# EAGLE design Startgate Controller-Mainboard (EAGLE 7.7.0)
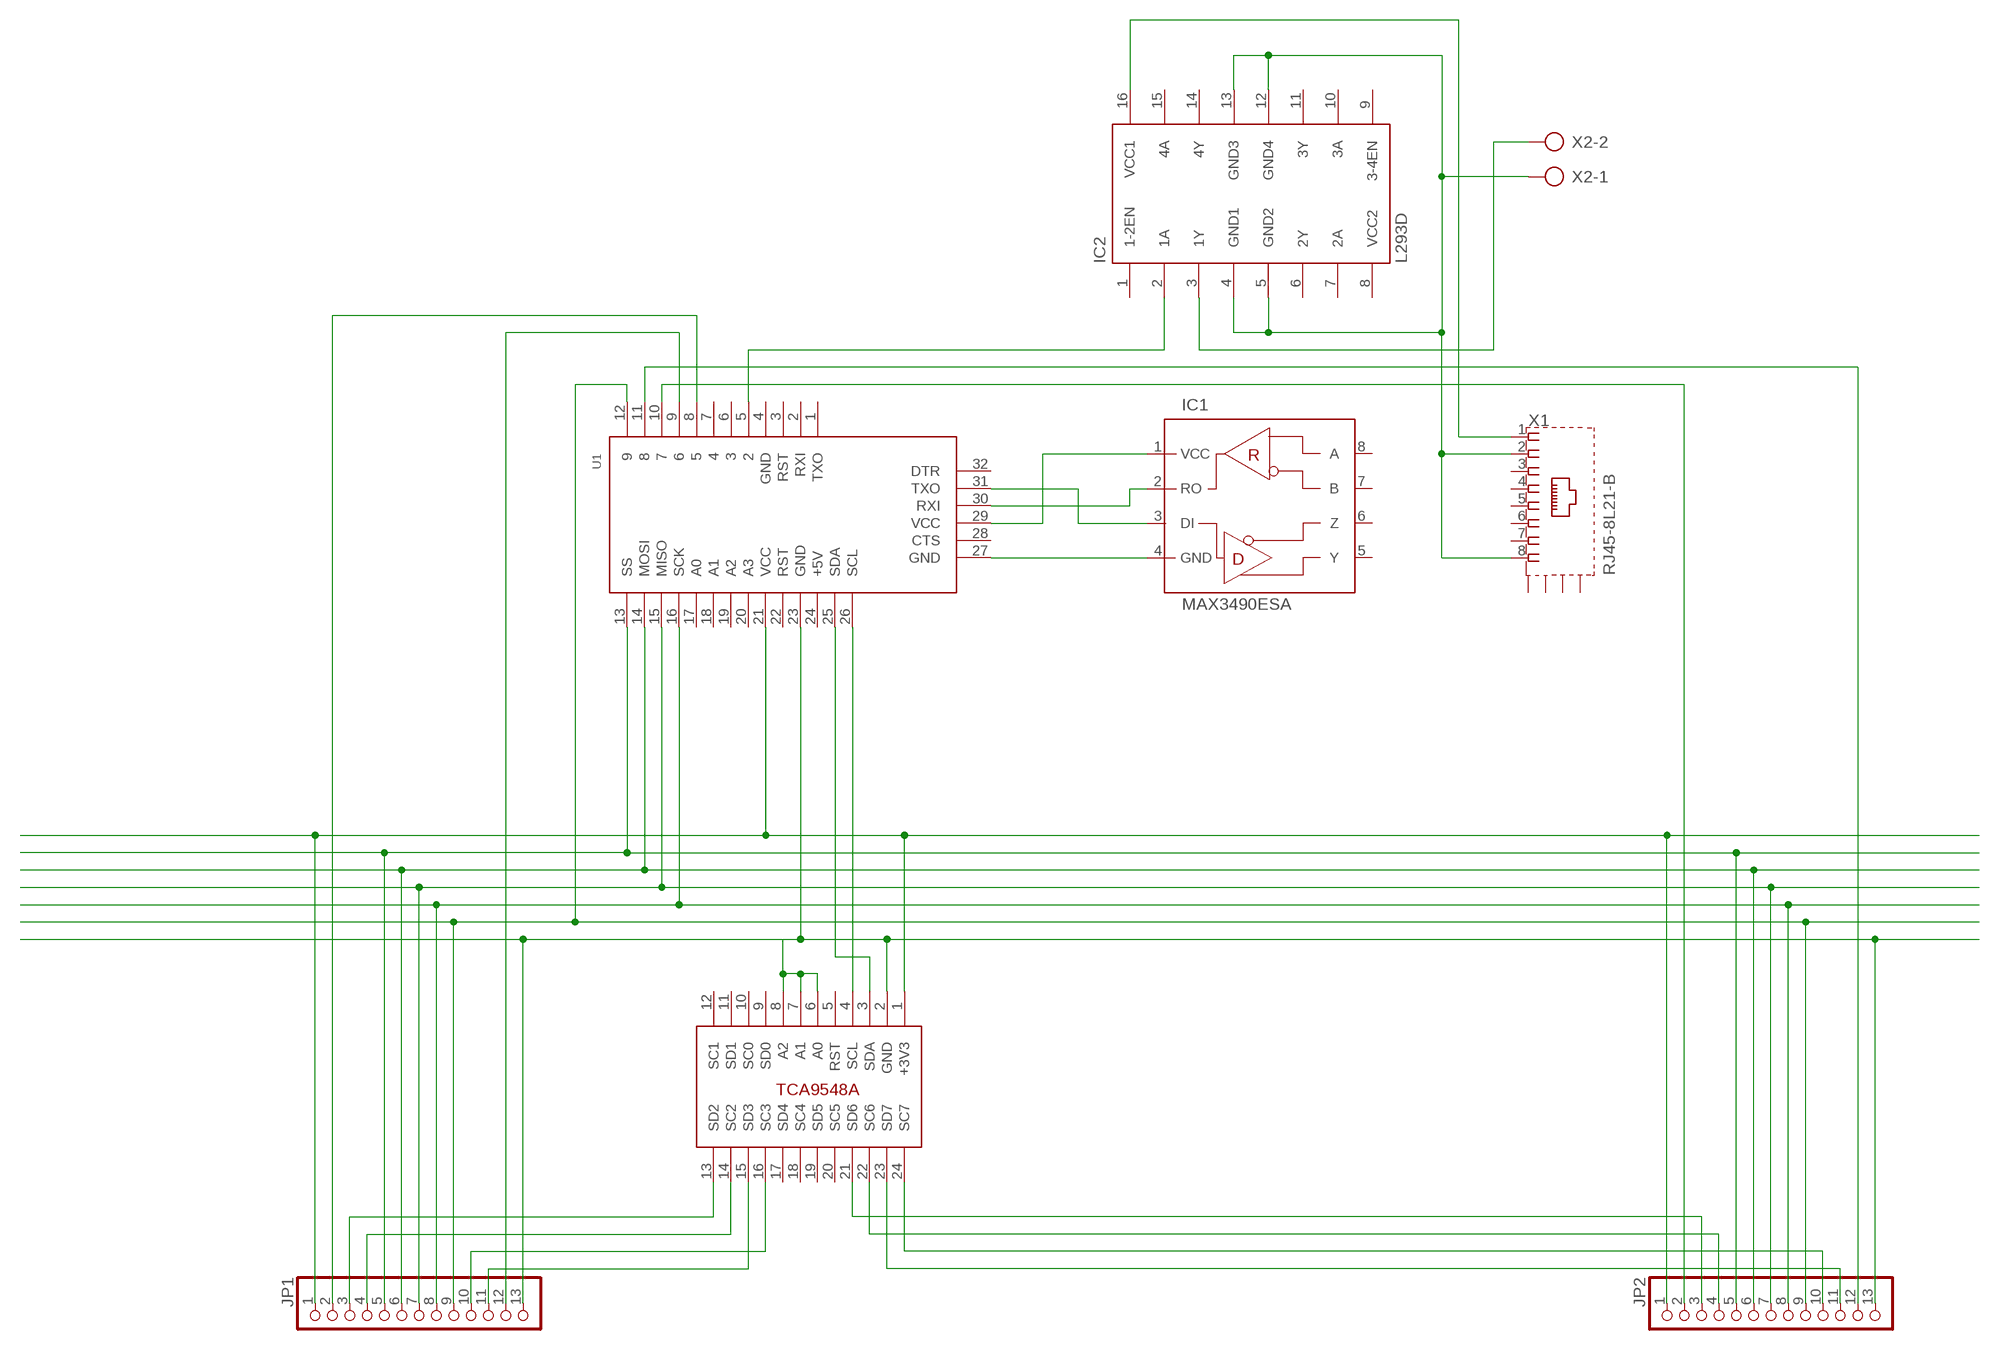
[diagram p0: schematic, sheet 1]

## Parts
IC1  MAX3490ESA  [SO08]
IC2  L293D  [DIL16]
JP1  PINHD-1X13  [1X13]
JP2  PINHD-1X13  [1X13]
U1  ARDUINOPROMINI  [ARDUINOPROMINI]
U$1  TCA9548A  [DIL24]
X1  RJ45-8L21-B  [RJ45-SHIELD1]
X2  AK300/2  [AK300/2]

## Nets
+3V3: IC1.1(VCC) JP1.1 JP2.1 U1.21(VCC) U1.29(VCC) U$1.1(+3V3)
ENA1: JP1.2 U1.8
ENA2: JP1.12 U1.9
ENA3: JP2.2 U1.10
ENA4: JP2.12 U1.11
GND: IC1.4(GND) JP1.13 JP2.13 U1.23(GND) U1.27(GND) U$1.2(GND) U$1.6(A0) U$1.7(A1) U$1.8(A2)
MISO: JP1.7 JP2.7 U1.15(MISO)
MOSI: JP1.6 JP2.6 U1.14(MOSI)
N$1: IC1.3(DI) U1.31(TXO)
N$2: IC1.2(RO) U1.30(RXI)
N$5: U1.26(SCL) U$1.4(SCL)
N$6: U1.25(SDA) U$1.3(SDA)
N$10: IC2.2(1A) U1.5
N$11: IC2.3(1Y) X2.2
N$12: IC2.16(VCC1) X1.1
N$13: IC2.4(GND1) IC2.5(GND2) IC2.12(GND4) IC2.13(GND3) X1.2 X1.8 X2.1
RST: JP1.9 JP2.9 U1.12
SCK: JP1.8 JP2.8 U1.16(SCK)
SCL1: JP1.4 U$1.14(SC2)
SCL2: JP1.10 U$1.16(SC3)
SCL3: JP2.4 U$1.22(SC6)
SCL4: JP2.10 U$1.24(SC7)
SDA1: JP1.3 U$1.13(SD2)
SDA2: JP1.11 U$1.15(SD3)
SDA3: JP2.3 U$1.21(SD6)
SDA4: JP2.11 U$1.23(SD7)
SS: JP1.5 JP2.5 U1.13(SS)
Unconnected: IC1.5(Y) IC1.6(Z) IC1.7(B) IC1.8(A) IC2.1(1-2EN) IC2.6(2Y) IC2.7(2A) IC2.9(3-4EN) IC2.10(3A) IC2.11(3Y) IC2.14(4Y) IC2.15(4A) U1.1(TXO) U1.2(RXI) U1.3(RST) U1.4(GND) U1.6 U1.7 U1.17(A0) U1.18(A1) U1.19(A2) U1.20(A3) U1.22(RST) U1.28(CTS) U1.32(DTR) U$1.5(RST) U$1.9(SD0) U$1.10(SC0) U$1.11(SD1) U$1.12(SC1) U$1.17(SD4) U$1.18(SC4) U$1.19(SD5) U$1.20(SC5) X1.3 X1.4 X1.5 X1.6 X1.7 X1.S1(S) X1.S2(S) X1.S3(S) X1.S4(S)

## Power pins joined to a net without a drawn wire
+5V: U1.24(+5V)
VCC2: IC2.8(VCC2)

## Library data of the parts
IC1 = miro:MAX3490: +3.3V 10Mbps, RS-485 Transceivers
IC2 = st-microelectronics:L293D: PUSH-PULL 4 CHANNEL DRIVER; MPN: L293D; OC_FARNELL: 9589619; OC_NEWARK: 56P8249
JP1 JP2 = pinhead:PINHD-1X13: PIN HEADER
U1 = miro:ARDUINOPROMINI: Arduino Pro Mini - the compete module
U$1 = miro:TCA9548A: TCA9548A is a low-voltage 8-channel I2C multiplexer
X1 = con-tycoelectronics:RJ45*2: RJ45 Low Profile Shield Type 2 For all RJ45 L, LC, LCT and X Series Models Source: www.tycoelectronics.com .. ENG_DS_1654001_1099_RJ_L_0507.pdf; OC_FARNELL: unknown; OC_NEWARK: unknown
X2 = con-ptr500:AK300/2: CONNECTOR; OC_FARNELL: unknown; OC_NEWARK: unknown

## Board
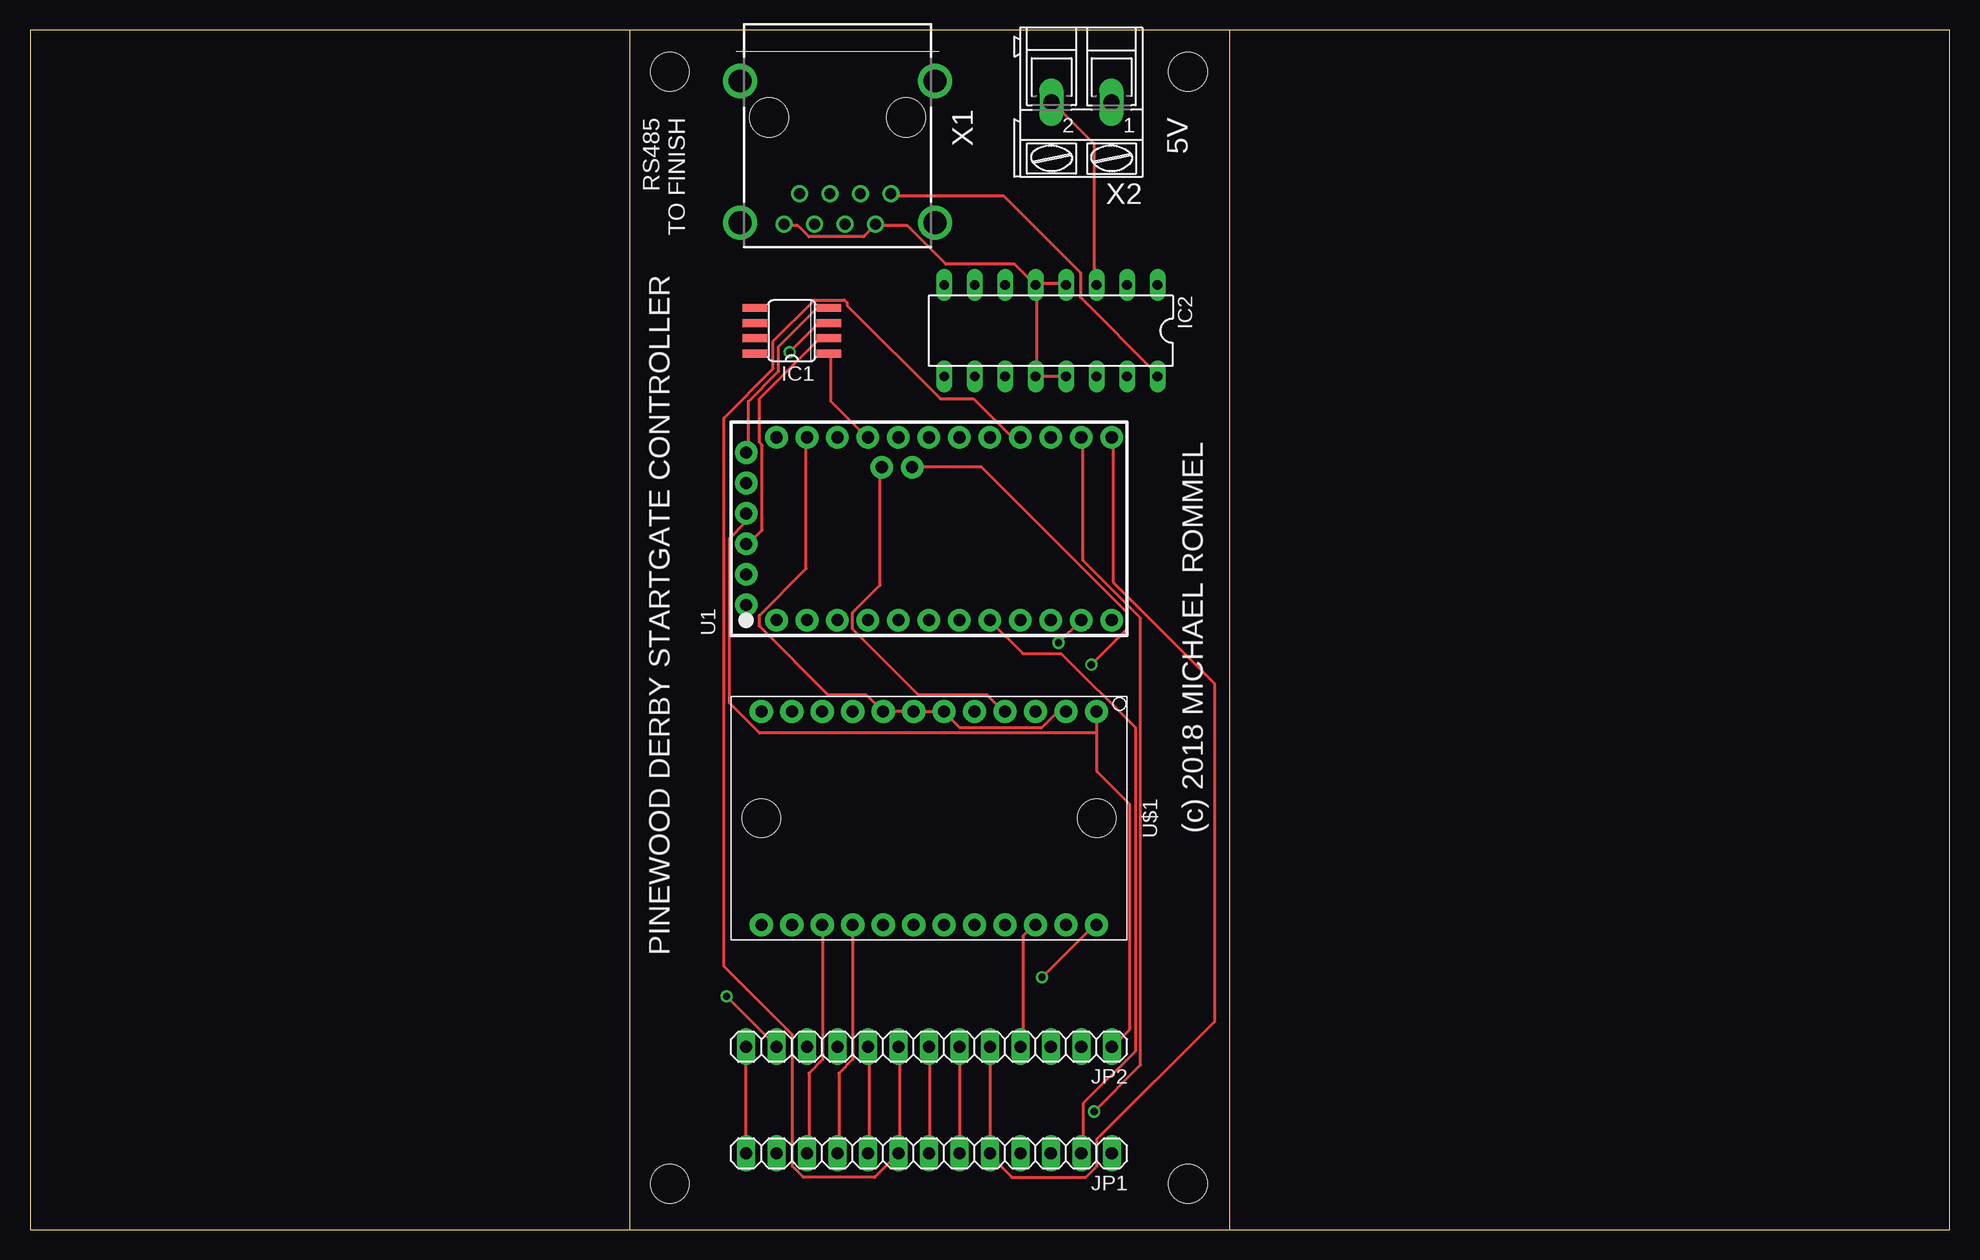
[diagram p1: board, top side]
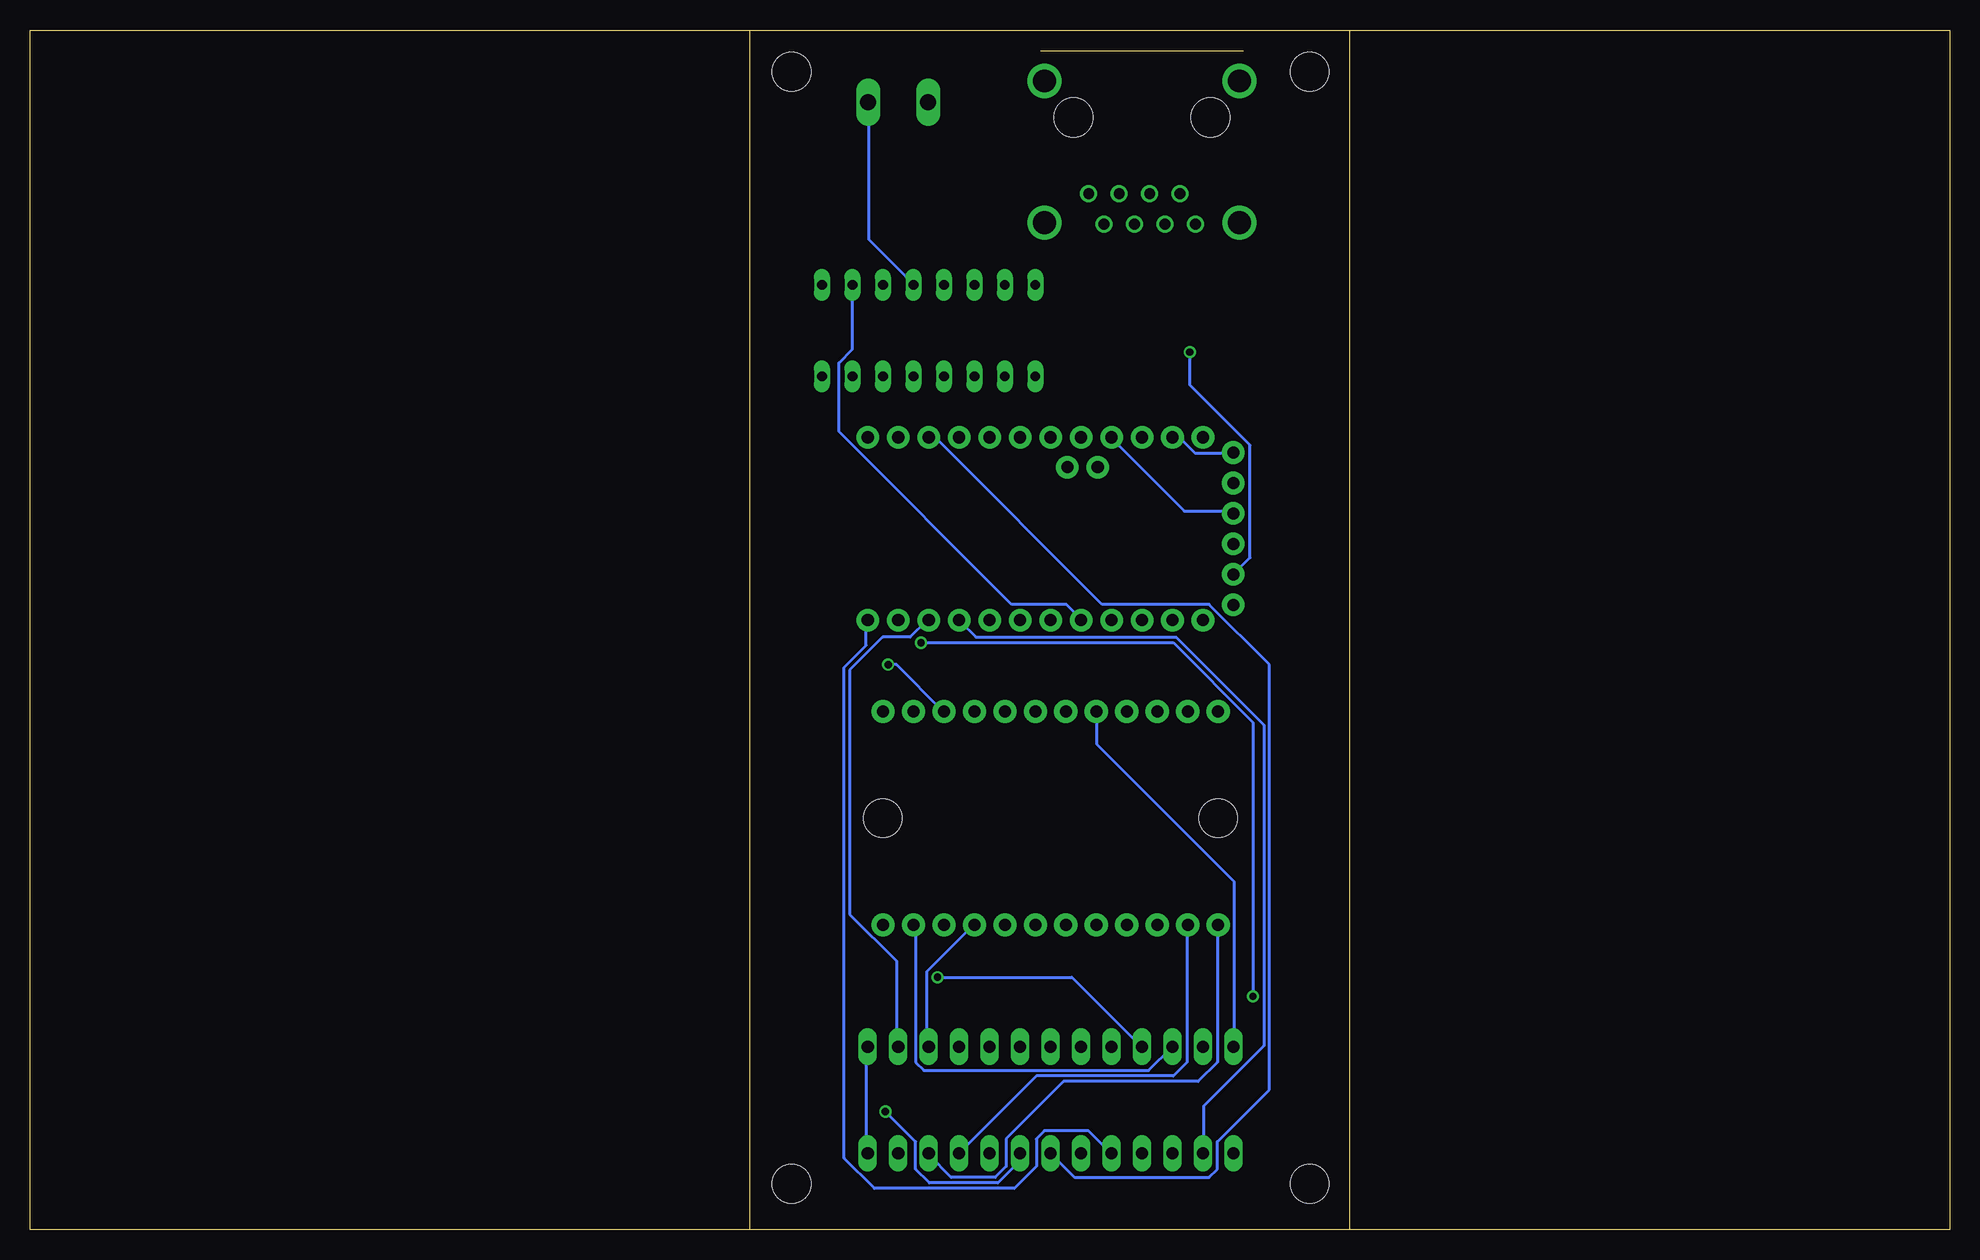
[diagram p2: board, bottom side, seen from below]

Size 160 x 100 mm. Coordinates in mm from the lower left corner, seen from the top.
Outline: 50,0 0,0 0,100 50,100
Outline: 50,0 100,0
Outline: 100,0 160,0 160,100 100,100
Outline: 100,100 50,100
Outline: 50,0 50,100
Outline: 100,0 100,100
Copper layers (1*16): Top 0.035mm / dielectric 1.5mm / Bottom 0.035mm
Design rules "default": minimum track width 10mil, minimum drill 24mil, track to track 8mil, track to pad 8mil, pad to pad 8mil, via to via 8mil, smd to smd 8mil, copper to edge 40mil, drill to drill 8mil, minimum pad ring 10mil, minimum via ring 8mil, stop-mask expansion 4mil, vias tented up to drill 0mil, thermal gap 10mil
Holes 3.2 mm at 53.34,96.52 96.52,96.52 53.34,3.81 96.52,3.81

### Footprints (pad centres in the part's own frame; a part is rotated, then mirrored left to right if it is on the bottom)
SO08 = smd 0.66 x 2.032: 1 -1.905,-3.073; 2 -0.635,-3.073; 3 0.635,-3.073; 4 1.905,-3.073; 5 1.905,3.073; 6 0.635,3.073; 7 -0.635,3.073; 8 -1.905,3.073
DIL16 = drill 0.813 long: 1 -8.89,-3.81; 2 -6.35,-3.81; 3 -3.81,-3.81; 4 -1.27,-3.81; 5 1.27,-3.81; 6 3.81,-3.81; 7 6.35,-3.81; 8 8.89,-3.81; 9 8.89,3.81; 10 6.35,3.81; 11 3.81,3.81; 12 1.27,3.81; 13 -1.27,3.81; 14 -3.81,3.81; 15 -6.35,3.81; 16 -8.89,3.81
1X13 = drill 1.016 long: 1 -15.24,0; 2 -12.7,0; 3 -10.16,0; 4 -7.62,0; 5 -5.08,0; 6 -2.54,0; 7 0,0; 8 2.54,0; 9 5.08,0; 10 7.62,0; 11 10.16,0; 12 12.7,0; 13 15.24,0
ARDUINOPROMINI = drill 1.016 pad 1.88: 1 1.27,29.21; 2 1.27,26.67; 3 1.27,24.13; 4 1.27,21.59; 5 1.27,19.05; 6 1.27,16.51; 7 1.27,13.97; 8 1.27,11.43; 9 1.27,8.89; 10 1.27,6.35; 11 1.27,3.81; 12 1.27,1.27; 13 16.51,1.27; 14 16.51,3.81; 15 16.51,6.35; 16 16.51,8.89; 17 16.51,11.43; 18 16.51,13.97; 19 16.51,16.51; 20 16.51,19.05; 21 16.51,21.59; 22 16.51,24.13; 23 16.51,26.67; 24 16.51,29.21; 25 14.021,17.907; 26 14.021,20.447; 27 15.24,31.75; 28 12.7,31.75; 29 10.16,31.75; 30 7.62,31.75; 31 5.08,31.75; 32 2.54,31.75
DIL24 = drill 1 pad 1.93: 1 1.27,30.48; 2 1.27,27.94; 3 1.27,25.4; 4 1.27,22.86; 5 1.27,20.32; 6 1.27,17.78; 7 1.27,15.24; 8 1.27,12.7; 9 1.27,10.16; 10 1.27,7.62; 11 1.27,5.08; 12 1.27,2.54; 13 19.05,2.54; 14 19.05,5.08; 15 19.05,7.62; 16 19.05,10.16; 17 19.05,12.7; 18 19.05,15.24; 19 19.05,17.78; 20 19.05,20.32; 21 19.05,22.86; 22 19.05,25.4; 23 19.05,27.94; 24 19.05,30.48 | hole 3.2: 10.16,30.48; 10.16,2.54
RJ45-SHIELD1 = drill 0.9 pad 1.4: 1 -4.445,6.35; 2 -3.175,8.89; 3 -1.905,6.35; 4 -0.635,8.89; 5 0.635,6.35; 6 1.905,8.89; 7 3.175,6.35; 8 4.445,8.89 | drill 1.9 pad 2.5: S1 -8.128,-3.048; S2 8.128,-3.048; S3 -8.128,8.76; S4 8.128,8.76 | hole 3.251: -5.715,0; 5.715,0
AK300/2 = drill 1.321 long: 1 -2.515,0; 2 2.489,0

### Placement (x,y rotation side)
IC1  63.5,74.93 90 top
IC2  85.09,74.93 180 top
JP1  74.93,6.35 180 top
JP2  74.93,15.24 180 top
U1  91.44,49.53 90 top
U$1  58.42,44.45 270 top
X1  67.31,92.71 180 top
X2  87.63,93.98 180 top

### Tracks (layer width: path | path; a pad name or v marks a point on that pad's centre or on a via)
+3V3
  Top 0.254: IC1.1 66.75,72.92 66.75,69.04 69.72,66.06 U1.21 | 88.92,41.38 88.92,38.18 91.67,35.43 91.67,16.69 90.3,15.32 JP2.1 | 88.92,41.38 88.92,42.98 U$1.1 | 88.92,41.38 60.81,41.38 58.29,43.89 58.29,57.61 59.66,58.98 59.66,59.66 U1.29
  Bottom 0.254: U1.29 59.89,59.89 63.78,59.89 69.72,65.84 U1.21 | JP1.1 90.3,6.4 90.3,15.09 JP2.1
ENA1
  Top 0.254: JP1.2 87.78,6.4 87.78,10.52 92.13,14.86 92.13,41.83 85.95,48.01 82.75,48.01 80.01,50.75 U1.8
ENA2
  Bottom 0.254: JP1.12 62.18,6.4 62.18,10.29 57.15,15.32 57.15,42.06 64.47,49.38 81.15,49.38 82.53,50.75 U1.9
ENA3
  Bottom 0.254: JP2.2 87.78,15.32 87.78,22.4 91.67,26.29 91.67,46.63 88.92,49.38 86.64,49.38 85.27,50.75 U1.10
ENA4  (via drill 0.61)
  Top 0.254: v58.06,19.43 62.18,15.32 JP2.12 | v85.72,48.92 87.55,50.75 U1.11
  Bottom 0.254: v58.06,19.43 58.06,42.29 64.69,48.92 v85.72,48.92
GND
  Top 0.254: IC1.4 66.52,76.81 65.61,76.81 62.41,73.61 62.41,71.55 59.89,69.04 59.89,64.92 U1.27 | JP1.13 59.66,6.4 59.66,15.09 JP2.13 | U$1.2 86.18,42.98 85.5,42.98 84.35,41.83 77.5,41.83 76.35,42.98 U$1.6 76.12,43.2 73.84,43.2 U$1.7 73.61,43.2 71.32,43.2 U$1.8 69.72,44.58 66.52,44.58 60.81,50.29 60.81,51.21 64.69,55.09 64.69,65.84 U1.23
  Bottom 0.254: U1.23 64.69,65.84 64.01,65.84 62.87,64.69 59.89,64.69 U1.27 | JP2.13 59.66,15.32 59.66,29.03 71.09,40.46 71.09,42.98 U$1.8
MISO
  Top 0.254: JP1.7 74.98,6.4 74.98,15.09 JP2.7
  Bottom 0.254: JP1.7 72.92,4.34 61.72,4.34 61.04,5.03 61.04,7.32 56.69,11.66 56.69,47.09 61.72,52.12 70.64,52.12 84.35,65.84 85.04,65.84 U1.15
MOSI  (via drill 0.61)
  Top 0.254: JP1.6 77.5,6.4 77.5,15.09 JP2.6 | v88.7,9.83 92.58,13.72 92.58,50.98 87.78,55.78 87.78,65.84 U1.14
  Bottom 0.254: v88.7,9.83 86.18,7.32 86.18,5.03 85.04,3.89 79.32,3.89 77.5,5.71 77.5,6.17 JP1.6
N$1  (via drill 0.61)
  Top 0.254: v63.32,73.15 65.61,75.44 66.52,75.44 IC1.3
  Bottom 0.254: v63.32,73.15 63.32,70.41 58.29,65.38 58.29,56.01 U1.31
N$2
  Top 0.254: IC1.2 65.84,74.3 60.81,69.27 60.81,65.61 61.04,65.38 61.04,58.29 59.89,57.15 U1.30
N$5
  Top 0.254: U1.26 70.87,63.55 70.87,53.72 68.58,51.44 68.58,50.06 74.07,44.58 79.78,44.58 81.15,43.2 U$1.4
N$6  (via drill 0.61)
  Top 0.254: U1.25 79.32,63.55 91.44,51.44 91.44,50.06 v88.47,47.09
  Bottom 0.254: v88.47,47.09 87.78,47.09 83.9,43.2 U$1.3
N$10
  Bottom 0.254: IC2.2 91.44,73.38 92.58,72.24 92.58,66.52 78.18,52.12 73.61,52.12 72.47,50.98 U1.5
N$11
  Top 0.254: IC2.3 88.7,78.87 88.7,90.53 85.27,93.95 X2.2
N$12
  Top 0.254: IC2.16 93.95,71.32 87.55,77.72 87.55,79.78 81.15,86.18 71.78,86.18 X1.1
N$13
  Top 0.254: IC2.13 86.18,71.09 83.9,71.09 IC2.12 83.9,71.32 83.9,78.64 IC2.5 | IC2.5 83.9,78.87 86.18,78.87 IC2.4 | X1.8 62.87,83.67 64.01,83.67 64.92,82.75 69.49,82.75 70.41,83.67 X1.2 70.64,83.67 73.15,83.67 76.35,80.47 82.07,80.47 83.67,78.87 IC2.5
  Bottom 0.254: X2.1 90.07,93.95 90.07,82.53 86.41,78.87 IC2.4
RST
  Top 0.254: JP1.9 69.95,6.4 69.95,15.09 JP2.9
  Bottom 0.254: U1.12 90.3,50.75 90.3,48.69 92.13,46.86 92.13,5.94 89.61,3.43 77.95,3.43 76.12,5.26 76.12,7.54 75.44,8.23 71.78,8.23 69.95,6.4 JP1.9
SCK
  Top 0.254: JP2.8 72.47,15.09 72.47,6.4 JP1.8 72.24,6.17 70.41,4.34 64.47,4.34 63.55,5.26 63.55,16.23 57.84,21.95 57.84,67.67 61.95,71.78 61.95,74.07 65.38,77.5 67.89,77.5 68.12,77.27 68.12,77.04 75.89,69.27 78.64,69.27 81.84,66.06 82.53,66.06 U1.16
SCL1
  Bottom 0.254: JP1.4 82.53,6.4 76.12,12.8 64.69,12.8 63.55,13.95 63.55,25.38 U$1.14
SCL2
  Top 0.254: U$1.16 68.58,14.17 67.44,13.03 67.44,6.4 JP1.10
SCL3
  Top 0.254: JP2.4 82.75,15.32 82.75,24.46 83.67,25.38 U$1.22
SCL4  (via drill 0.61)
  Top 0.254: v84.35,21.03 88.7,25.38 U$1.24
  Bottom 0.254: v84.35,21.03 73.15,21.03 67.44,15.32 JP2.10
SDA1
  Bottom 0.254: JP1.3 85.04,6.17 83.21,4.34 79.55,4.34 78.64,5.26 78.64,7.54 73.84,12.34 62.64,12.34 61.04,13.95 61.04,25.38 U$1.13
SDA2
  Top 0.254: JP1.11 64.92,6.4 64.92,13.03 66.06,14.17 66.06,25.38 U$1.15
SDA3
  Bottom 0.254: JP2.3 85.27,15.32 85.27,21.49 81.38,25.38 U$1.21
SDA4
  Bottom 0.254: JP2.11 66.75,13.26 85.5,13.26 86.18,13.95 86.18,25.38 U$1.23
SS
  Top 0.254: JP2.5 JP1.5 80.01,6.17 81.84,4.34 88.01,4.34 88.92,5.26 88.92,7.54 98.75,17.37 98.75,45.49 90.3,53.95 90.3,65.84 U1.13

### Text on the board
tNames: RS485 / TO FINISH | 5V | (c) 2018 MICHAEL ROMMEL | PINEWOOD DERBY STARTGATE CONTROLLER